# Altium project DASHBOARD_HW.PrjPcb
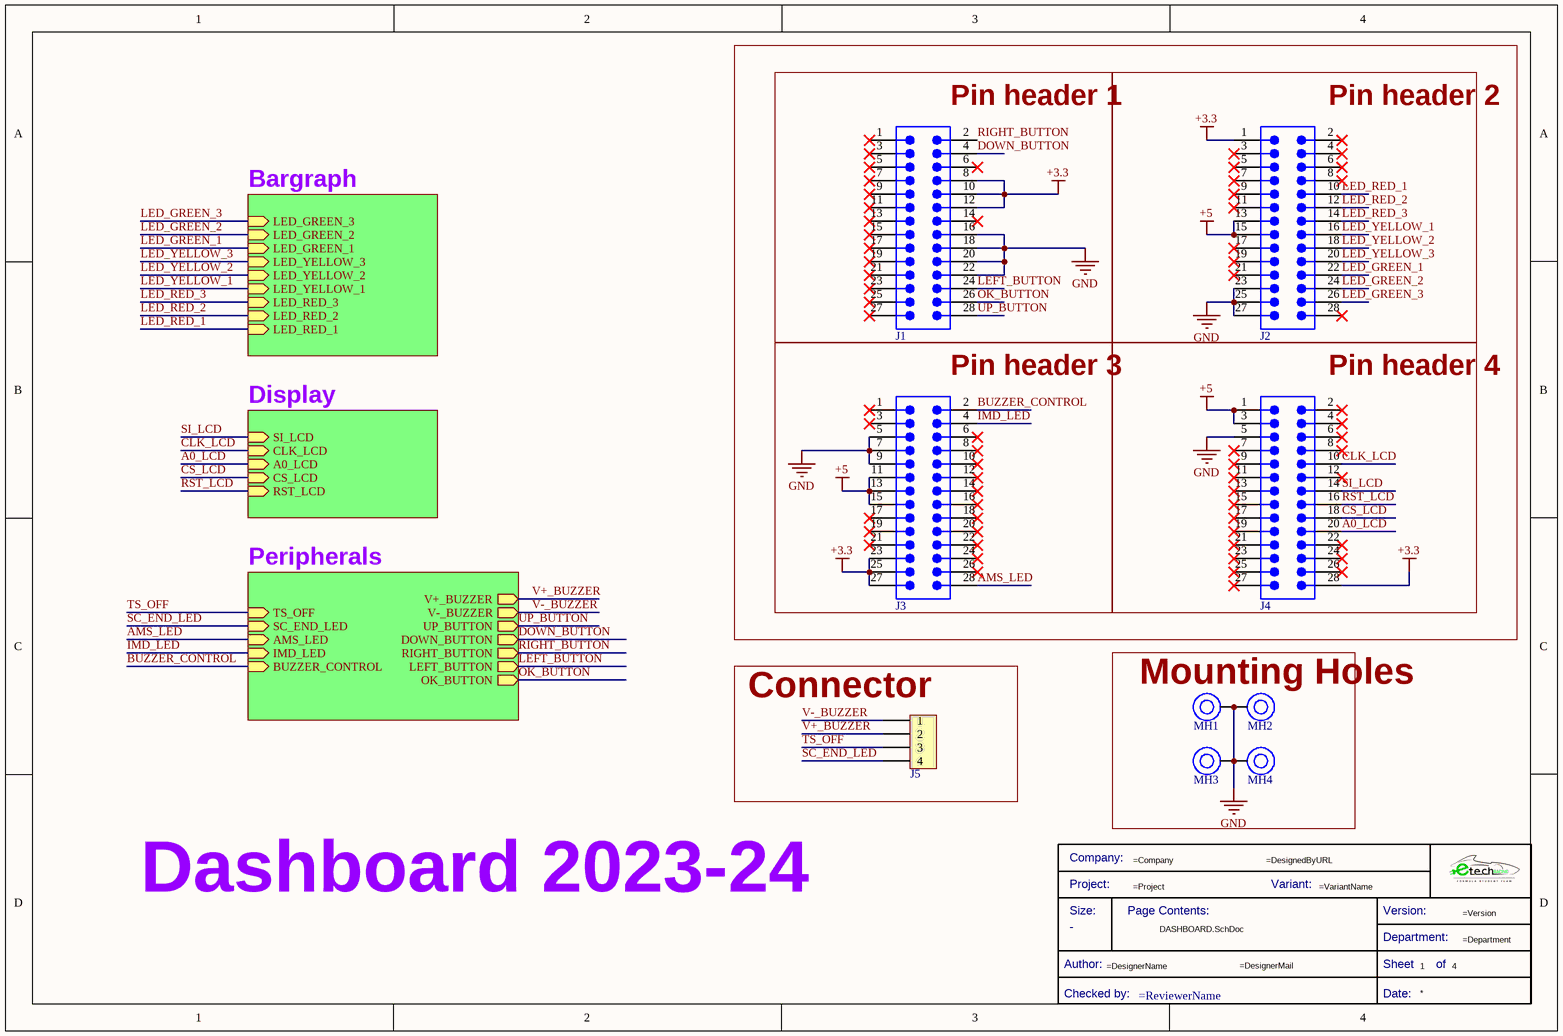
[diagram p0: DASHBOARD.SchDoc]
4 sheets, 98 parts. Net scope: hierarchical (ports join the sheet entries above them; power ports are global).
Board file: DASHBOARD.PcbDoc
Sheets:
  DASHBOARD.SchDoc
    Bargraph = Bargraph.SchDoc
    Display = Display.SchDoc
    Peripherals = Peripherals.SchDoc

## Sheet DASHBOARD.SchDoc
size A4; SheetNumber: 1; SheetTotal: 4

### Parts
(Parts that share a designator on the sheet are numbered #1, #2 ... from top to bottom, then left to right.)
*#1  Title Block_template  (value not drawn)  (graphical)
J1  62132821021  [62132821021]  (value not drawn)
J2  62132821021  [62132821021]  (value not drawn)
J3  62132821021  [62132821021]  (value not drawn)
J4  62132821021  [62132821021]  (value not drawn)
J5  436500400  [J_MicroFit_1x4]  (value not drawn)
MH1  Mounting_Hole_M3  [Mounting_Hole_M3]  (value not drawn)
MH2  Mounting_Hole_M3  [Mounting_Hole_M3]  (value not drawn)
MH3  Mounting_Hole_M3  [Mounting_Hole_M3]  (value not drawn)
MH4  Mounting_Hole_M3  [Mounting_Hole_M3]  (value not drawn)

### Blocks framed on the sheet
Pin header 1: J1
Pin header 2: J2
Pin header 3: J3
Pin header 4: J4
Connector: J5
Mounting Holes: MH1-MH4

### Sub-sheets
Bargraph = Bargraph: LED_GREEN_3 (in), LED_GREEN_2 (in), LED_GREEN_1 (in), LED_YELLOW_3 (in), LED_YELLOW_2 (in), LED_YELLOW_1 (in), LED_RED_3 (in), LED_RED_2 (in), LED_RED_1 (in)
Display = Display: SI_LCD (in), CLK_LCD (in), A0_LCD (in), CS_LCD (in), RST_LCD (in)
Peripherals = Peripherals.SchDoc: AMS_LED (in), IMD_LED (in), UP_BUTTON (out), DOWN_BUTTON (out), RIGHT_BUTTON (out), LEFT_BUTTON (out), OK_BUTTON (out), V+_BUZZER (out), V-_BUZZER (out), SC_END_LED (in), TS_OFF (in), BUZZER_CONTROL (in)

### Nets
+3.3: J1.8 J1.10 J1.12 J2.1 J3.23 J3.25 J3.27 J4.28
+5: J2.13 J2.15 J3.11 J3.13 J3.15 J4.1 J4.3
GND: J1.16 J1.18 J1.20 J1.22 J2.23 J2.25 J2.27 J3.5 J3.7 J3.9 J4.5 MH1.1 MH2.1 MH3.1 MH4.1
A0_LCD: J4.20 ; sheet Display/A0_LCD
AMS_LED: J3.28 ; sheet Peripherals/AMS_LED
BUZZER_CONTROL: J3.2 ; sheet Peripherals/BUZZER_CONTROL
CLK_LCD: J4.10 ; sheet Display/CLK_LCD
CS_LCD: J4.18 ; sheet Display/CS_LCD
DOWN_BUTTON: J1.4 ; sheet Peripherals/DOWN_BUTTON
IMD_LED: J3.4 ; sheet Peripherals/IMD_LED
LED_GREEN_1: J2.22 ; sheet Bargraph/LED_GREEN_1
LED_GREEN_2: J2.24 ; sheet Bargraph/LED_GREEN_2
LED_GREEN_3: J2.26 ; sheet Bargraph/LED_GREEN_3
LED_RED_1: J2.10 ; sheet Bargraph/LED_RED_1
LED_RED_2: J2.12 ; sheet Bargraph/LED_RED_2
LED_RED_3: J2.14 ; sheet Bargraph/LED_RED_3
LED_YELLOW_1: J2.16 ; sheet Bargraph/LED_YELLOW_1
LED_YELLOW_2: J2.18 ; sheet Bargraph/LED_YELLOW_2
LED_YELLOW_3: J2.20 ; sheet Bargraph/LED_YELLOW_3
LEFT_BUTTON: J1.24 ; sheet Peripherals/LEFT_BUTTON
OK_BUTTON: J1.26 ; sheet Peripherals/OK_BUTTON
RIGHT_BUTTON: J1.2 ; sheet Peripherals/RIGHT_BUTTON
RST_LCD: J4.16 ; sheet Display/RST_LCD
SC_END_LED: J5.4 ; sheet Peripherals/SC_END_LED
SI_LCD: J4.14 ; sheet Display/SI_LCD
TS_OFF: J5.3 ; sheet Peripherals/TS_OFF
UP_BUTTON: J1.28 ; sheet Peripherals/UP_BUTTON
V+_BUZZER: J5.2 ; sheet Peripherals/V+_BUZZER
V-_BUZZER: J5.1 ; sheet Peripherals/V-_BUZZER

Not connected (* = marked no-connect by the designer): J1 1* 3* 5* 6* 7* 9* 11* 13* 14* 15* 17* 19* 21* 23* 25* 27*; J2 2* 3* 4* 5* 6* 7* 8* 9* 11* 17* 19* 21* 28*; J3 1* 3* 6* 8* 10* 12* 14* 16* 17* 18* 19* 20* 21* 22* 24* 26*; J4 2* 4* 6* 7* 8* 9* 11* 12* 13* 15* 17* 19* 21* 22* 23* 24* 25* 26* 27*

### Notes on the sheet
- Dashboard 2023-24
- (in symbol Title Block_template) Company:; Project:; Variant:; Size:; Page Contents:; Version:; Department:; Author:; Sheet; of; Checked by:; Date:

### Library data of the parts
*#1 = Title Block_template: Standard Title Block; .Creator: GP; Category: Title Block; .PCBcheck: GP; .SCHcheck: GP; Checked by:: =ReviewerName; Size: -
J1-J4 = 62132821021: WR-PHD Pin Header, SMT, Vertical, pitch 1.27mm, 2 Row, 28P; Manufacturer: Wurth Elektronik; Contact Resistance: 20mΩ; Rated Current: 1A; Working Voltage: 100V; Withstanding Voltage: 500V; ComponentLink1Description: Website Link; ComponentLink1URL: https://www.we-online.com/redexpert/article/62132821021?ad; ComponentLink2Description: Datasheet Link; ComponentLink2URL: https://www.we-online.com/redexpert/spec/62132821021?ad; Manufacturer Part Number: 62132821021; Category: Board-to-Board Connectors; Match Code: WR-PHD; Mount: Surface Mount; Operating Temperature Max: 105°C; Operating Temperature Min: -40°C; Packaging: Tape and Reel; Gender: Pin Header; Number of Pins: 28; Number of Rows: 2; Orientation: Vertical; Pitch: 1.27mm
J5 = J_MicroFit_1x4: Connector Wire to Board Header 4 Position 3mm Solder Right Angle Thru-Hole Tray; Manufacturer 1: Molex; Manufacturer Part Number 1: 43650-0400; Current Rating: 5A; Voltage Rating: 600V; Contact Resistance: 10mR; Connector Type: Plug; Number of Positions: 4; Gender: Male; Voltage Rating (DC): 250V; Glow Wire Compliant: Compliant; Supplier 1: Farnell; RoHS: Yes; Category: Headers and Wire Housings; Stock 1: 4623; Pricing 1: 1=1,24000, 10=1,22000, 50=1,19000, 100=1,17000, 500=1,14000, 1000=1,12000 (EUR); Mount: Through Hole,Cable; Contact Material: Brass,Copper Alloy; Contact Plating: Tin; Color: Black; Housing Color: Black; Housing Material: Thermoplastic; Min Operating Temperature: -40°C; Max Operating Temperature: 105°C; Termination: Solder; Orientation: Right Angle; Number of Rows: 1; Packaging: Tray; Package Quantity: 2380; Number of Contacts: 4; Max Voltage Rating (AC): 600V; Number of Circuits: 4; Series: 43650; Length: 14.86mm; Height: 4.5mm; Pitch: 3mm; Depth: 3.6mm; Radiation Hardening: No; Halogen Free: Low Halogen; Lead Free: Contains Lead; Flammability Rating: UL94 V-0; RoHS Compliant: Yes; ComponentLink1URL: https://datasheet.ciiva.com/19462/884184-19462234.pdf?src-supplier=Jameco; ComponentLink1Description: https://datasheet.ciiva.com/19462/884184-19462234.pdf?src-supplier=Jameco; ComponentLink2URL: https://datasheet.ciiva.com/5151/0436500400-pcb-headers-148663-5151881.pdf?src-supplier=Mouser; ComponentLink2Description: https://datasheet.ciiva.com/5151/0436500400-pcb-headers-148663-5151881.pdf?src-supplier=Mouser; ComponentLink3URL: https://datasheet.ciiva.com/16085/0436500400-pcb-headers-16085752.pdf?src-supplier=Onlinecomponents.com; ComponentLink3Description: https://datasheet.ciiva.com/16085/0436500400-pcb-headers-16085752.pdf?src-supplier=Onlinecomponents.com; ComponentLink4URL: https://datasheet.ciiva.com/11748/0900766b80d6135b-11748178.pdf?src-supplier=RSComponents; ComponentLink4Description: https://datasheet.ciiva.com/11748/0900766b80d6135b-11748178.pdf?src-supplier=RSComponents; ComponentLink5URL: https://datasheet.ciiva.com/30221/142510436500400-pcb-headers-30221164.pdf?src-supplier=Onlinecomponents.com; ComponentLink5Description: https://datasheet.ciiva.com/30221/142510436500400-pcb-headers-30221164.pdf?src-supplier=Onlinecomponents.com; ComponentLink6URL: https://datasheet.ciiva.com/17080/70266896-17080471.pdf?src-supplier=Allied+Electronics; ComponentLink6Description: https://datasheet.ciiva.com/17080/70266896-17080471.pdf?src-supplier=Allied+Electronics; ComponentLink7URL: https://datasheet.ciiva.com/7094/1946229-7094763.pdf?src-supplier=Newark; ComponentLink7Description: https://datasheet.ciiva.com/7094/1946229-7094763.pdf?src-supplier=Newark; ComponentLink8URL: https://datasheet.ciiva.com/9449/0436500400-pcb-headers-9449446.pdf?src-supplier=Avnet; ComponentLink8Description: https://datasheet.ciiva.com/9449/0436500400-pcb-headers-9449446.pdf?src-supplier=Avnet; Supplier Part Number 1: 1012232

## Sheet Bargraph.SchDoc
size A4; SheetNumber: 2; SheetTotal: 4
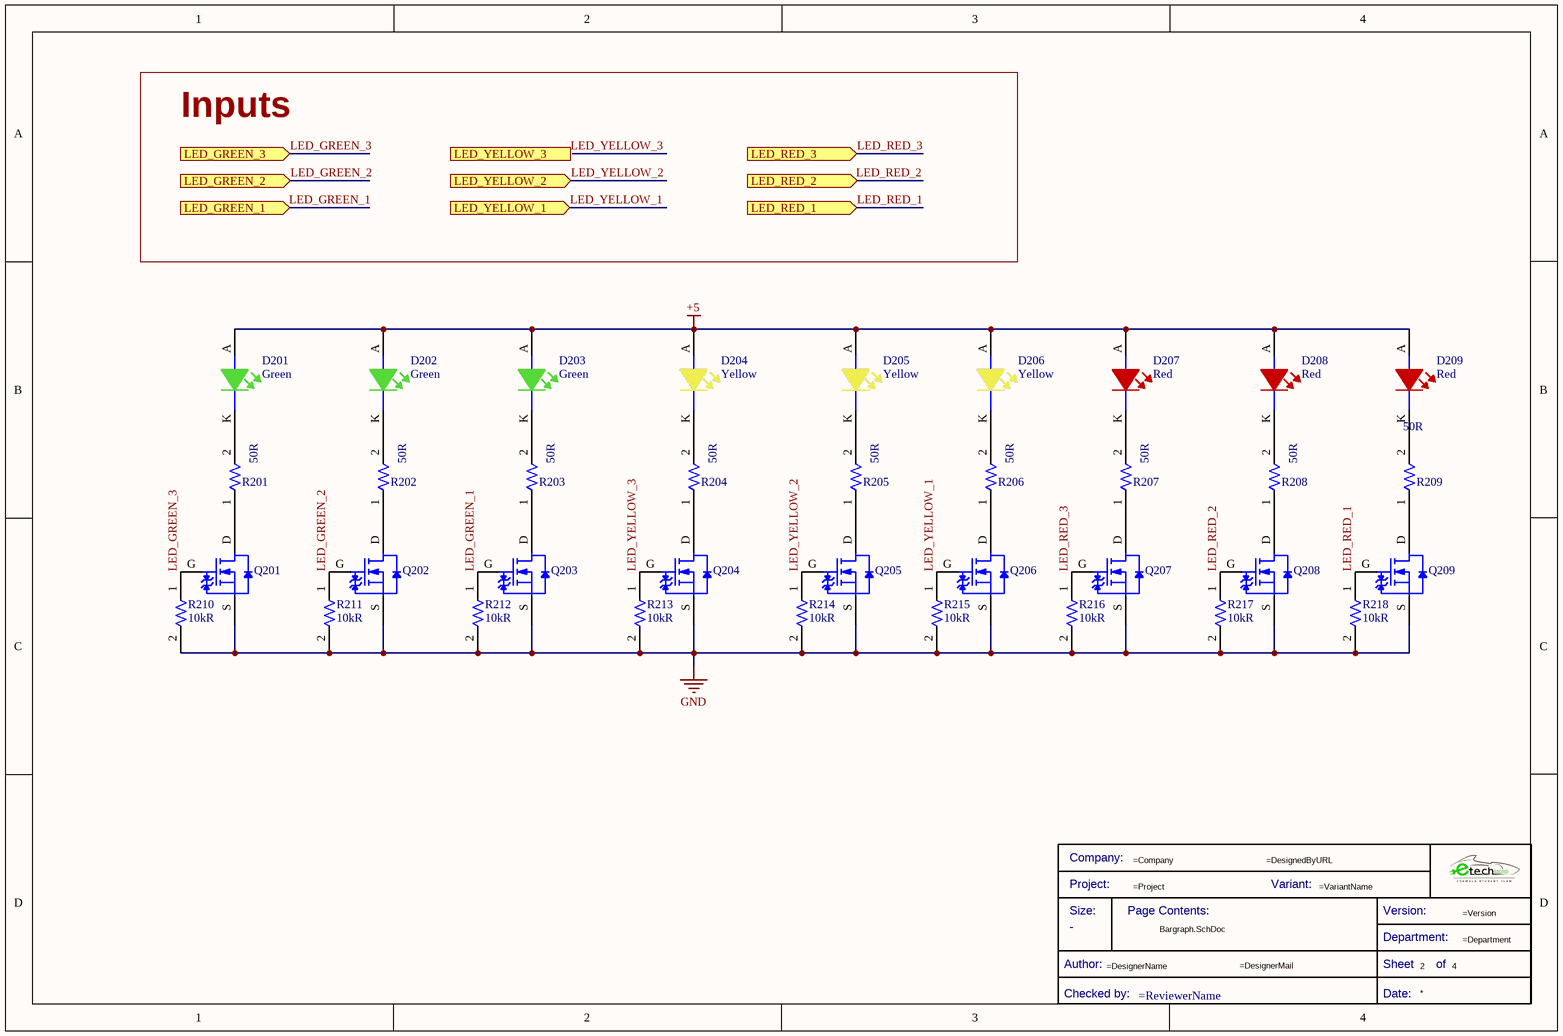
[diagram p1: Bargraph.SchDoc]

### Parts
(Parts that share a designator on the sheet are numbered #1, #2 ... from top to bottom, then left to right.)
*#2  Title Block_template  (value not drawn)  (graphical)
D201  Color: Green  [LED-THT/WE/D3.9H10.5]  (hidden comment: 150080GS75000)
D202  Color: Green  [LED-THT/WE/D3.9H10.5]  (hidden comment: 150080GS75000)
D203  Color: Green  [LED-THT/WE/D3.9H10.5]  (hidden comment: 150080GS75000)
D204  Color: Yellow  [LED-THT/WE/D3.9H10.5]  (hidden comment: 150080YS75000)
D205  Color: Yellow  [LED-THT/WE/D3.9H10.5]  (hidden comment: 150080YS75000)
D206  Color: Yellow  [LED-THT/WE/D3.9H10.5]  (hidden comment: 150080YS75000)
D207  Color: Red  [LED-THT/WE/D3.9H10.5]  (hidden comment: 150080RS75000)
D208  Color: Red  [LED-THT/WE/D3.9H10.5]  (hidden comment: 150080RS75000)
D209  Color: Red  [LED-THT/WE/D3.9H10.5]  (hidden comment: 150080RS75000)
Q201  CPH3455-TL-H  [TRT-NCH-3/35-CPH]  (value not drawn)
Q202  CPH3455-TL-H  [TRT-NCH-3/35-CPH]  (value not drawn)
Q203  CPH3455-TL-H  [TRT-NCH-3/35-CPH]  (value not drawn)
Q204  CPH3455-TL-H  [TRT-NCH-3/35-CPH]  (value not drawn)
Q205  CPH3455-TL-H  [TRT-NCH-3/35-CPH]  (value not drawn)
Q206  CPH3455-TL-H  [TRT-NCH-3/35-CPH]  (value not drawn)
Q207  CPH3455-TL-H  [TRT-NCH-3/35-CPH]  (value not drawn)
Q208  CPH3455-TL-H  [TRT-NCH-3/35-CPH]  (value not drawn)
Q209  CPH3455-TL-H  [TRT-NCH-3/35-CPH]  (value not drawn)
R201  value 50R  [R0805FTK]  (hidden comment: CRCW080550R0FKTA)
R202  value 50R  [R0805FTK]  (hidden comment: CRCW080550R0FKTA)
R203  value 50R  [R0805FTK]  (hidden comment: CRCW080550R0FKTA)
R204  value 50R  [R0805FTK]  (hidden comment: CRCW080550R0FKTA)
R205  value 50R  [R0805FTK]  (hidden comment: CRCW080550R0FKTA)
R206  value 50R  [R0805FTK]  (hidden comment: CRCW080550R0FKTA)
R207  value 50R  [R0805FTK]  (hidden comment: CRCW080550R0FKTA)
R208  value 50R  [R0805FTK]  (hidden comment: CRCW080550R0FKTA)
R209  value 50R  [R0805FTK]  (hidden comment: CRCW080550R0FKTA)
R210  Resistance: 10kR  [R0805FTK]  (hidden comment: CR0805-JW-103ELF)
R211  Resistance: 10kR  [R0805FTK]  (hidden comment: CR0805-JW-103ELF)
R212  Resistance: 10kR  [R0805FTK]  (hidden comment: CR0805-JW-103ELF)
R213  Resistance: 10kR  [R0805FTK]  (hidden comment: CR0805-JW-103ELF)
R214  Resistance: 10kR  [R0805FTK]  (hidden comment: CR0805-JW-103ELF)
R215  Resistance: 10kR  [R0805FTK]  (hidden comment: CR0805-JW-103ELF)
R216  Resistance: 10kR  [R0805FTK]  (hidden comment: CR0805-JW-103ELF)
R217  Resistance: 10kR  [R0805FTK]  (hidden comment: CR0805-JW-103ELF)
R218  Resistance: 10kR  [R0805FTK]  (hidden comment: CR0805-JW-103ELF)

### Ports
LED_GREEN_1 (in, see DASHBOARD[1A]), LED_GREEN_2 (in, see DASHBOARD[1A]), LED_GREEN_3 (in, see DASHBOARD[1A]), LED_RED_1 (in, see DASHBOARD[1B]), LED_RED_2 (in, see DASHBOARD[1B]), LED_RED_3 (in, see DASHBOARD[1B]), LED_YELLOW_1 (in, see DASHBOARD[1B]), LED_YELLOW_2 (in, see DASHBOARD[1B]), LED_YELLOW_3 (in, see DASHBOARD[1B])

### Nets
+5: D201.A D202.A D203.A D204.A D205.A D206.A D207.A D208.A D209.A
GND: Q201.S Q202.S Q203.S Q204.S Q205.S Q206.S Q207.S Q208.S Q209.S R210.2 R211.2 R212.2 R213.2 R214.2 R215.2 R216.2 R217.2 R218.2
LED_GREEN_1: Q203.G R212.1
LED_GREEN_2: Q202.G R211.1 ; port LED_GREEN_2
LED_GREEN_3: Q201.G R210.1 ; port LED_GREEN_3
LED_RED_1: Q209.G R218.1 ; port LED_RED_1
LED_RED_2: Q208.G R217.1
LED_RED_3: Q207.G R216.1 ; port LED_RED_3
LED_YELLOW_1: Q206.G R215.1 ; port LED_YELLOW_1
LED_YELLOW_2: Q205.G R214.1 ; port LED_YELLOW_2
LED_YELLOW_3: Q204.G R213.1 ; port LED_YELLOW_3
NetD201_K: D201.K R201.2
NetD202_K: D202.K R202.2
NetD203_K: D203.K R203.2
NetD204_K: D204.K R204.2
NetD205_K: D205.K R205.2
NetD206_K: D206.K R206.2
NetD207_K: D207.K R207.2
NetD208_K: D208.K R208.2
NetD209_K: D209.K R209.2
NetQ201_D: Q201.D R201.1
NetQ202_D: Q202.D R202.1
NetQ203_D: Q203.D R203.1
NetQ204_D: Q204.D R204.1
NetQ205_D: Q205.D R205.1
NetQ206_D: Q206.D R206.1
NetQ207_D: Q207.D R207.1
NetQ208_D: Q208.D R208.1
NetQ209_D: Q209.D R209.1

### Notes on the sheet
- Inputs
- Labels drawn without touching a wire or pin: LED_GREEN_1, LED_RED_2
- (in symbol Title Block_template) Company:; Project:; Variant:; Size:; Page Contents:; Version:; Department:; Author:; Sheet; of; Checked by:; Date:

### Library data of the parts
*#2 = Title Block_template: Standard Title Block; .Creator: GP; Category: Title Block; .PCBcheck: GP; .SCHcheck: GP; Checked by:: =ReviewerName; Size: -
D201-D203 = LEDGS-THT: Led, Green, 520 Nm, 3.2 V, 30 Ma, 450 Mcd Rohs Compliant: Yes; Manufacturer 1: Wurth Electronics; Viewing Angle: 140°; Lens Style: Clear,Rectangular; Luminous Intensity: 450mcd; Forward Voltage: 3.2V; Wavelength: 520nm; Forward Current: 30mA; Test Current: 20mA; .Creator: GP; ComponentLink1Description: Datasheet; ComponentLink1URL: https://www.we-online.com/catalog/datasheet/150080GS75000.pdf; ComponentLink2Description: Where buy it; ComponentLink2URL: https://katalog.we-online.de/en/led/WL-SMCW/150080GS75000; Supplier 1: RSComponents; Manufacturer Part Number 1: 150080GS75000; RoHS: Yes; Category: LEDs; Stock 1: 4350; Pricing 1: 50=0,19300, 500=0,12900, 1000=0,12300, 2000=0,11700, 4000=0,11100 (USD); Mount: Surface Mount; Case/Package: 0805; Case Code (Metric): 2012; Case Code (Imperial): 0805; Min Operating Temperature: -40°C; Max Operating Temperature: 85°C; Package Quantity: 4000; Packaging: Cut Tape; Dominant Wavelength: 520nm; Length: 2mm; Width: 1.25mm; Height: 0.7mm; REACH SVHC: Unknown; RoHS Compliant: Yes; ComponentLink3URL: https://datasheet.ciiva.com/29563/150080gs75000-29563008.pdf?src-supplier=Digi-Key; ComponentLink3Description: https://datasheet.ciiva.com/29563/150080gs75000-29563008.pdf?src-supplier=Digi-Key; ComponentLink4URL: https://datasheet.ciiva.com/29279/759434-da-01-en-chipled-0805-w-kl-gruen-150080gs75000-29279039.pdf?src-supplier=Conrad; ComponentLink4Description: https://datasheet.ciiva.com/29279/759434-da-01-en-chipled-0805-w-kl-gruen-150080gs75000-29279039.pdf?src-supplier=Conrad; Supplier Part Number 1: 8154221
D204-D206 = LEDYS-THT: 2 V Yellow LED 2012 (0805) SMD, Wurth Elektronik WL-SMCW 150080YS75000; Manufacturer 1: Wurth Electronics; Luminous Intensity: 120mcd; Forward Current: 30mA; Forward Voltage: 2V; Viewing Angle: 140°; Wavelength: 590nm; Lens Style: Clear,Rectangular; Test Current: 20mA; .Creator: DR; ComponentLink1Description: Datasheet; ComponentLink1URL: https://www.we-online.com/catalog/datasheet/150080YS75000.pdf; ComponentLink2Description: Where buy it; ComponentLink2URL: https://katalog.we-online.de/en/led/WL-SMCW/150080YS75000; Supplier 1: RSComponents; Manufacturer Part Number 1: 150080YS75000; RoHS: Yes; Category: LEDs; Stock 1: 2100; Pricing 1: 50=0,19300, 500=0,12900, 750=0,12300, 1500=0,11700, 3000=0,11100 (USD); Mount: Surface Mount; Case/Package: 0805; Case Code (Metric): 2012; Case Code (Imperial): 0805; Min Operating Temperature: -40°C; Max Operating Temperature: 85°C; Package Quantity: 4000; Packaging: Tape and Reel; Dominant Wavelength: 590nm; Length: 2mm; Width: 1.25mm; Height: 0.7mm; REACH SVHC: Unknown; RoHS Compliant: Yes; ComponentLink3URL: https://datasheet.ciiva.com/23843/150080ys75000-23843256.pdf?src-supplier=Newark; ComponentLink3Description: https://datasheet.ciiva.com/23843/150080ys75000-23843256.pdf?src-supplier=Newark; ComponentLink4URL: https://datasheet.ciiva.com/29279/759438-da-01-en-chipled-0805-w-kl-gelb-150080ys75000-29279034.pdf?src-supplier=Conrad; ComponentLink4Description: https://datasheet.ciiva.com/29279/759438-da-01-en-chipled-0805-w-kl-gelb-150080ys75000-29279034.pdf?src-supplier=Conrad; ComponentLink5URL: https://datasheet.ciiva.com/22656/1911353-22656971.pdf?src-supplier=Element14; ComponentLink5Description: https://datasheet.ciiva.com/22656/1911353-22656971.pdf?src-supplier=Element14; ComponentLink6URL: https://datasheet.ciiva.com/29563/150080ys75000-29563019.pdf?src-supplier=Digi-Key; ComponentLink6Description: https://datasheet.ciiva.com/29563/150080ys75000-29563019.pdf?src-supplier=Digi-Key; ComponentLink7URL: https://datasheet.ciiva.com/29563/150080ys75000-29563020.pdf?src-supplier=Digi-Key; ComponentLink7Description: https://datasheet.ciiva.com/29563/150080ys75000-29563020.pdf?src-supplier=Digi-Key; ComponentLink8URL: https://datasheet.ciiva.com/29563/150080ys75000-29563021.pdf?src-supplier=Digi-Key; ComponentLink8Description: https://datasheet.ciiva.com/29563/150080ys75000-29563021.pdf?src-supplier=Digi-Key; Supplier Part Number 1: 8154231
D207-D209 = LEDRS-THT: 0805(H=0.8mm) 红色 高亮 λD=625nm VF=2V IF=30mA PD=72mW; Manufacturer 1: Wurth Electronics; Luminous Intensity: 150mcd; Viewing Angle: 140°; Forward Voltage: 2V; Wavelength: 625nm; Lens Style: Clear,Rectangular; Forward Current: 30mA; Test Current: 20mA; .Creator: DR; ComponentLink1Description: Datasheet; ComponentLink1URL: https://www.we-online.com/catalog/datasheet/150080RS75000.pdf; ComponentLink2Description: Where buy it; ComponentLink2URL: https://katalog.we-online.de/en/led/WL-SMCW/150080RS75000; Supplier 1: RSComponents; Manufacturer Part Number 1: 150080RS75000; RoHS: Yes; Category: LEDs; Stock 1: 1; Pricing 1: 50=0,19300, 500=0,12900, 1000=0,12300, 2000=0,11700, 4000=0,11100 (USD); Mount: Surface Mount; Case/Package: 0805; Case Code (Metric): 2012; Case Code (Imperial): 0805; Min Operating Temperature: -40°C; Max Operating Temperature: 85°C; Package Quantity: 4000; Packaging: Tape and Reel; Dominant Wavelength: 625nm; Length: 2mm; Width: 1.25mm; Height: 0.7mm; REACH SVHC: Unknown; RoHS Compliant: Yes; ComponentLink3URL: https://datasheet.ciiva.com/22656/150080rs75000-22656961.pdf?src-supplier=Element14; ComponentLink3Description: https://datasheet.ciiva.com/22656/150080rs75000-22656961.pdf?src-supplier=Element14; ComponentLink4URL: https://datasheet.ciiva.com/29279/759435-da-01-en-chipled-0805-w-kl-rot-150080rs75000-29279032.pdf?src-supplier=Conrad; ComponentLink4Description: https://datasheet.ciiva.com/29279/759435-da-01-en-chipled-0805-w-kl-rot-150080rs75000-29279032.pdf?src-supplier=Conrad; Supplier Part Number 1: 8154225P
Q201-Q209 = TRT-NCH-3/35-CPH: CPH3455-TL-H N-channel MOSFET Transistor; 3 A; 35 V; 3-Pin CPH; Manufacturer: ON Semiconductor; Rds On Max: 104mR; Input Capacitance: 186pF; Rise Time: 4.7ns; Drain to Source Voltage (Vdss): 35V; Continuous Drain Current (ID): 3A; Max Power Dissipation: 1W; Drain to Source Resistance: 108mR; Turn-On Delay Time: 4.2ns; Turn-Off Delay Time: 15ns; Fall Time: 5.7ns; Element Configuration: Single; Gate to Source Voltage (Vgs): 20V; .Creator: GP; Category: Transistor; ComponentLink1Description: Datasheet; ComponentLink1URL: https://docs.rs-online.com/5847/0900766b812d514d.pdf; ComponentLink2Description: Where buy it; ComponentLink2URL: https://es.rs-online.com/web/p/mosfet/8009989; Supplier 1: RSComponents; Manufacturer Part Number: CPH3455-TL-H; RoHS: Yes; Stock 1: 1; Pricing 1: 50=0,50400 (USD); Case/Package: SC; Number of Pins: 3; Min Operating Temperature: -55°C; Max Operating Temperature: 150°C; Package Quantity: 3000; Packaging: Tape and Reel; Drain to Source Breakdown Voltage: 35V; Power Dissipation: 1W; Polarity: N-CHANNEL; Series: -; Length: 2.9mm; Width: 1.6mm; Height: 0.9mm; Lead Free: Lead Free; Halogen Free: Halogen Free; RoHS Compliant: Yes; ComponentLink3URL: https://datasheet.ciiva.com/947/cph3455-d-947201.pdf?src-supplier=Digi-Key; ComponentLink3Description: https://datasheet.ciiva.com/947/cph3455-d-947201.pdf?src-supplier=Digi-Key; ComponentLink4URL: https://datasheet.ciiva.com/4444/cph3455-d-91653-4444616.pdf?src-supplier=Mouser; ComponentLink4Description: https://datasheet.ciiva.com/4444/cph3455-d-91653-4444616.pdf?src-supplier=Mouser; ComponentLink5URL: https://datasheet.ciiva.com/11164/cph3455-d-11164889.pdf?src-supplier=Avnet; ComponentLink5Description: https://datasheet.ciiva.com/11164/cph3455-d-11164889.pdf?src-supplier=Avnet; Supplier Part Number 1: 8009989
R201-R209 = R50-0805FTK: Res Thick Film 0805 50 Ohm 1% 0.125W(1/8W) ±100ppm/C Pad SMD Automotive T/R; Manufacturer: Vishay Dale; Power Rating: 125mW; Voltage Rating: 150V; Temperature Coefficient: 100ppm/°C; Supplier 1: Mouser; Manufacturer Part Number: CRCW080550R0FKTA; RoHS: No; Category: Chip SMD Resistors; Stock 1: 38245; Pricing 1: 1=0,25, 10=0,204, 50=0,204, 100=0,08, 1000=0,033, 10000=0,026 (USD); Case/Package: 0805; Weight: 0.000194oz; Case Code (Imperial): 0805; Case Code (Metric): 2012; Contact Plating: Tin,Lead; Min Operating Temperature: -55°C; Max Operating Temperature: 155°C; Tolerance: 1%; Packaging: Tape and Reel; Package Quantity: 5000; Series: CRCW; Length: 2mm; Width: 1.25mm; Height: 0.45mm; Lead Free: Contains Lead; RoHS Compliant: No; ComponentLink1URL: https://datasheet.ciiva.com/48525/dcrcw-48525895.pdf?src-supplier=Avnet; ComponentLink1Description: https://datasheet.ciiva.com/48525/dcrcw-48525895.pdf?src-supplier=Avnet; Supplier Part Number 1: 71-CRCW0805-50
R210-R218 = R10k-0805FTK: BOURNS         CR0805-JW-103ELF            Surface Mount Chip Resistor, Thick Film, CR Series, 10 kohm, 125 mW,  5%, 150 V; Temperature Coefficient: 200ppm/°C; Power Rating: 125mW; Voltage Rating: 150V; Voltage Rating (DC): 100V; .Creator: DR; Supplier 1: Arrow Electronics; Manufacturer 1: Bourns; Manufacturer Part Number 1: CR0805-JW-103ELF; RoHS: Yes; Category: Chip SMD Resistors; Stock 1: 57566; Pricing 1: 1=0,05790, 10=0,01540, 25=0,01340, 100=0,00340 (USD); Mount: Surface Mount; Case/Package: 0805; Number of Pins: 2; Contact Plating: Tin; Case Code (Metric): 2012; Case Code (Imperial): 0805; Min Operating Temperature: -55°C; Max Operating Temperature: 155°C; Tolerance: 5%; Resistor Type: Thick Film; Package Quantity: 1; Packaging: Tape and Reel; Number of Terminations: 2; Termination: SMD/SMT; Max Power Dissipation: 125mW; Features: Moisture Resistant; Series: CR0805; Construction: Rectangular; Resistance Tolerance: 5%; Technology: THICK FILM; Length: 2mm; Width: 1.25mm; Height: 0.5mm; Depth: 1.25mm; Thickness: 508um; Radiation Hardening: No; REACH SVHC: No SVHC; Military Standard: Not; RoHS Compliant: Yes; ComponentLink1URL: https://datasheet.ciiva.com/11821/0900766b80fcdb72-11821135.pdf?src-supplier=RSComponents; ComponentLink1Description: https://datasheet.ciiva.com/11821/0900766b80fcdb72-11821135.pdf?src-supplier=RSComponents; ComponentLink2URL: https://datasheet.ciiva.com/9122/chpreztr-9122374.pdf?src-supplier=Avnet; ComponentLink2Description: https://datasheet.ciiva.com/9122/chpreztr-9122374.pdf?src-supplier=Avnet; ComponentLink3URL: https://datasheet.ciiva.com/22693/1902866-22693254.pdf?src-supplier=Element14; ComponentLink3Description: https://datasheet.ciiva.com/22693/1902866-22693254.pdf?src-supplier=Element14; ComponentLink4URL: https://datasheet.ciiva.com/7986/691949-7986187.pdf?src-supplier=Element14; ComponentLink4Description: https://datasheet.ciiva.com/7986/691949-7986187.pdf?src-supplier=Element14; ComponentLink5URL: https://datasheet.ciiva.com/30065/159chpreztr-30065976.pdf?src-supplier=Onlinecomponents.com; ComponentLink5Description: https://datasheet.ciiva.com/30065/159chpreztr-30065976.pdf?src-supplier=Onlinecomponents.com; ComponentLink6URL: https://datasheet.ciiva.com/16783/70154685-16783482.pdf?src-supplier=Allied+Electronics; ComponentLink6Description: https://datasheet.ciiva.com/16783/70154685-16783482.pdf?src-supplier=Allied+Electronics; ComponentLink7URL: https://datasheet.ciiva.com/5548/chpreztr-5548491.pdf?src-supplier=Mouser; ComponentLink7Description: https://datasheet.ciiva.com/5548/chpreztr-5548491.pdf?src-supplier=Mouser; ComponentLink8URL: https://datasheet.ciiva.com/6559/chpreztr-6559900.pdf?src-supplier=Digi-Key; ComponentLink8Description: https://datasheet.ciiva.com/6559/chpreztr-6559900.pdf?src-supplier=Digi-Key; ComponentLink9URL: https://datasheet.ciiva.com/6559/chpreztr-6559901.pdf?src-supplier=Digi-Key; ComponentLink9Description: https://datasheet.ciiva.com/6559/chpreztr-6559901.pdf?src-supplier=Digi-Key; ComponentLink10URL: https://datasheet.ciiva.com/7985/1856384-7985869.pdf?src-supplier=Element14; ComponentLink10Description: https://datasheet.ciiva.com/7985/1856384-7985869.pdf?src-supplier=Element14; ComponentLink11URL: https://datasheet.ciiva.com/48692/001055517-da-01-en-smd-wid-cr0805-jw-103elf-10k-ohm-1-8w-48692118.pdf?src-supplier=Conrad; ComponentLink11Description: https://datasheet.ciiva.com/48692/001055517-da-01-en-smd-wid-cr0805-jw-103elf-10k-ohm-1-8w-48692118.pdf?src-supplier=Conrad; Supplier Part Number 1: CR0805-JW-103ELF

## Sheet Display.SchDoc
size A4; SheetNumber: 3; SheetTotal: 4
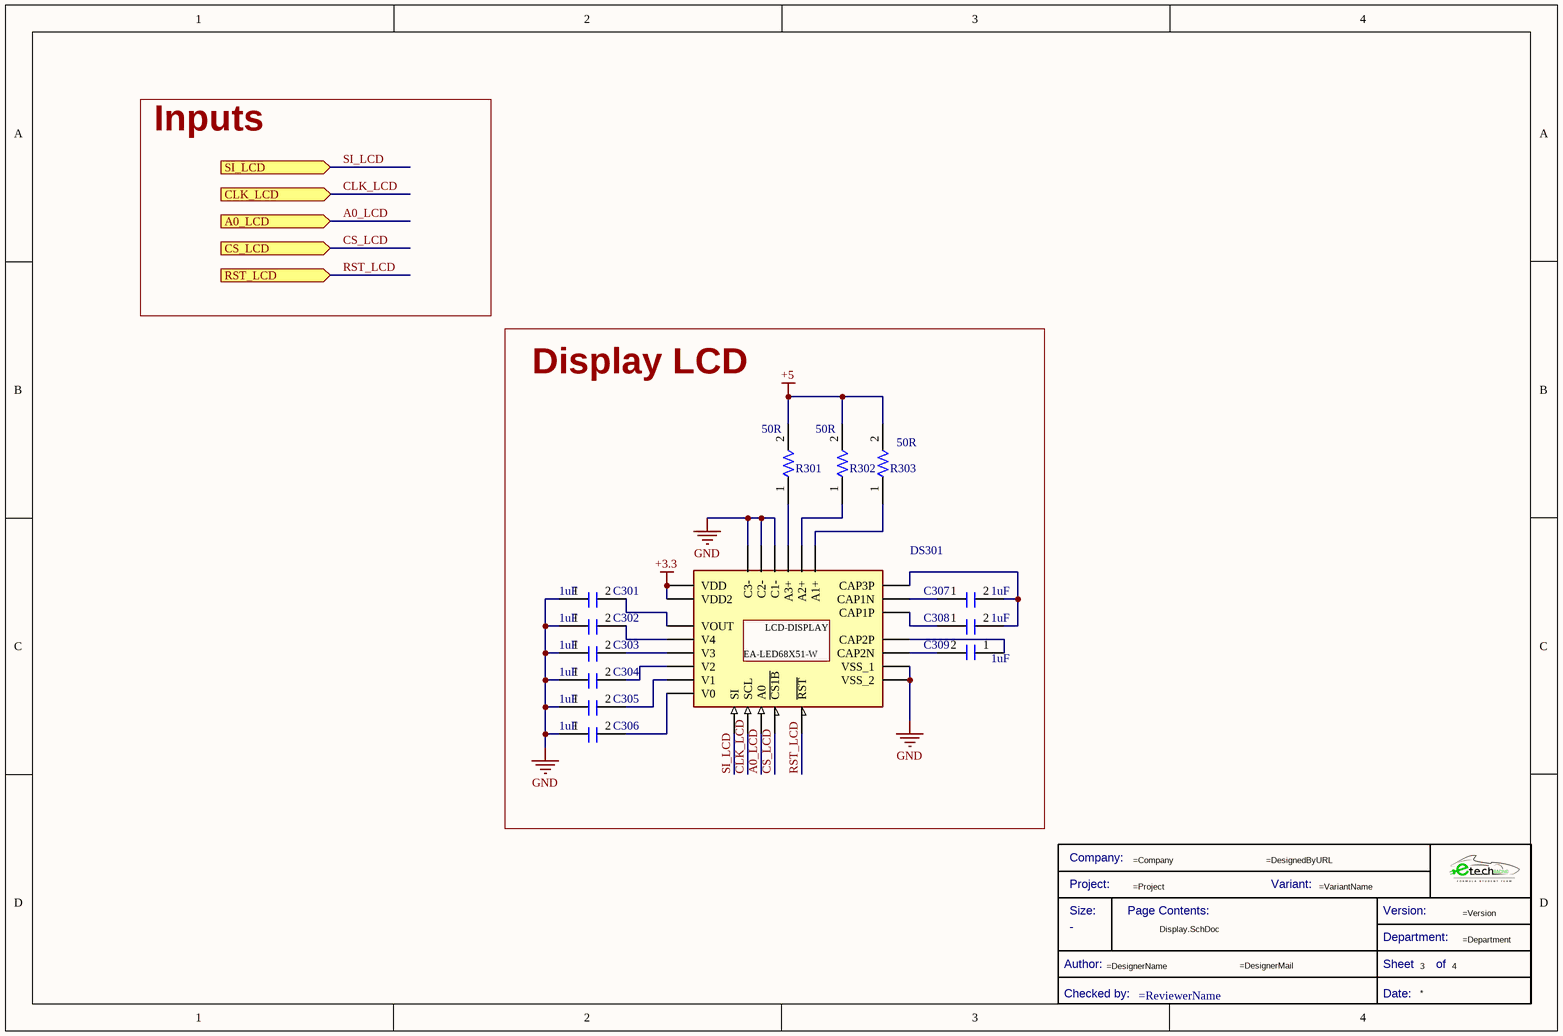
[diagram p2: Display.SchDoc]

### Parts
(Parts that share a designator on the sheet are numbered #1, #2 ... from top to bottom, then left to right.)
*#3  Title Block_template  (value not drawn)  (graphical)
C301  Capacitance: 1uF  [C0805FNPC-R]  (hidden comment: 885012207103)
C302  Capacitance: 1uF  [C0805FNPC-R]  (hidden comment: 885012207103)
C303  Capacitance: 1uF  [C0805FNPC-R]  (hidden comment: 885012207103)
C304  Capacitance: 1uF  [C0805FNPC-R]  (hidden comment: 885012207103)
C305  Capacitance: 1uF  [C0805FNPC-R]  (hidden comment: 885012207103)
C306  Capacitance: 1uF  [C0805FNPC-R]  (hidden comment: 885012207103)
C307  Capacitance: 1uF  [C0805FNPC-R]  (hidden comment: 885012207103)
C308  Capacitance: 1uF  [C0805FNPC-R]  (hidden comment: 885012207103)
C309  Capacitance: 1uF  [C0805FNPC-R]  (hidden comment: 885012207103)
DS301  EA_DOGL128W-6  [EA_DOGL128W-6]  (value not drawn)
R301  value 50R  [R0805FTK]  (hidden comment: CRCW080550R0FKTA)
R302  value 50R  [R0805FTK]  (hidden comment: CRCW080550R0FKTA)
R303  value 50R  [R0805FTK]  (hidden comment: CRCW080550R0FKTA)

### Blocks framed on the sheet
Display LCD: C301-C309 DS301 R301-R303

### Ports
A0_LCD (in, see DASHBOARD[1B]), CLK_LCD (in, see DASHBOARD[1B]), CS_LCD (in, see DASHBOARD[1B]), RST_LCD (in, see DASHBOARD[1C]), SI_LCD (in, see DASHBOARD[1B])

### Nets
+3.3: DS301.34(VDD2) DS301.35(VDD)
+5: R301.2 R302.2 R303.2
GND: C301.1 C302.1 C303.1 C304.1 C305.1 C306.1 DS301.18(C1-) DS301.19(C2-) DS301.20(C3-) DS301.26(VSS_1) DS301.33(VSS_2)
A0_LCD: DS301.38(A0) ; port A0_LCD
CLK_LCD: DS301.37(SCL) ; port CLK_LCD
CS_LCD: DS301.40(~{CS1B}) ; port CS_LCD
RST_LCD: DS301.39(~{RST}) ; port RST_LCD
SI_LCD: DS301.36(SI) ; port SI_LCD
NetC301_2: C301.2 DS301.32(VOUT)
NetC302_2: C302.2 DS301.25(V4)
NetC303_2: C303.2 DS301.24(V3)
NetC304_2: C304.2 DS301.23(V2)
NetC305_2: C305.2 DS301.22(V1)
NetC306_2: C306.2 DS301.21(V0)
NetC307_1: C307.1 DS301.30(CAP1N)
NetC307_2: C307.2 C308.2 DS301.31(CAP3P)
NetC308_1: C308.1 DS301.29(CAP1P)
NetC309_1: C309.1 DS301.28(CAP2P)
NetC309_2: C309.2 DS301.27(CAP2N)
NetDS301_1: DS301.1(A1+) R303.1
NetDS301_2: DS301.2(A2+) R302.1
NetDS301_3: DS301.3(A3+) R301.1

### Notes on the sheet
- Inputs
- (in symbol EA_DOGL128W-6) LCD-DISPLAY; EA-LED68X51-W
- (in symbol Title Block_template) Company:; Project:; Variant:; Size:; Page Contents:; Version:; Department:; Author:; Sheet; of; Checked by:; Date:

### Library data of the parts
*#3 = Title Block_template: Standard Title Block; .Creator: GP; Category: Title Block; .PCBcheck: GP; .SCHcheck: GP; Checked by:: =ReviewerName; Size: -
C301-C309 = C1u-50V-0805FNPC-X7R: Multilayer Ceramic Capacitor, Wcap-Csgp Series, 1 F, 10%, X7R, 50 V, 0805 [2012 Metric] Rohs Compliant: Yes; Manufacturer 1: Wurth Electronics; Voltage Rating: 50V; .Creator: GP; Supplier 1: RSComponents; Manufacturer Part Number 1: 885012207103; RoHS: Yes; Category: Ceramic Capacitors; Stock 1: 5100; Pricing 1: 50=0,27200, 250=0,25300, 500=0,22800, 1250=0,20100, 2500=0,17100 (GBP); Mount: Surface Mount; Case/Package: 0805; Case Code (Metric): 2012; Case Code (Imperial): 0805; Min Operating Temperature: -55°C; Max Operating Temperature: 85°C; Packaging: Cut Tape; Dielectric: X7R; Tolerance: 10%; Voltage Rating (DC): 50V; Length: 0.079inch; Width: 0.049inch; Thickness: 0.053inch; REACH SVHC: Unknown; RoHS Compliant: Yes; ComponentLink1URL: http://www.farnell.com/datasheets/1958501.pdf?src-supplier=Farnell; ComponentLink1Description: http://www.farnell.com/datasheets/1958501.pdf?src-supplier=Farnell; ComponentLink2URL: http://www.farnell.com/datasheets/1958501.pdf?src-supplier=Element14; ComponentLink2Description: http://www.farnell.com/datasheets/1958501.pdf?src-supplier=Element14; ComponentLink3URL: https://katalog.we-online.de/pbs/datasheet/885012107003.pdf?src-supplier=Digi-Key; ComponentLink3Description: https://katalog.we-online.de/pbs/datasheet/885012107003.pdf?src-supplier=Digi-Key; ComponentLink4URL: http://www.farnell.com/datasheets/1958501.pdf?src-supplier=Newark; ComponentLink4Description: http://www.farnell.com/datasheets/1958501.pdf?src-supplier=Newark; Supplier Part Number 1: 1813523
DS301 = EA_DOGL128W-6: LCD Graphic Display Modules & Accessories FSTN (+) Transflectv White Background; Manufacturer_Name: Electronic Assembly GmbH; Manufacturer_Part_Number: EA DOGL128W-6; Manufacturer: Electronic Assembly; Manufacturer Part Number: EADOGL128W-6; Nominal Supply Current: 270uA; Resolution (height): 64pixel; Resolution (width): 128pixel; Interface: SPI; Viewing Area (width): 64mm; Viewing Area (height): 35mm; .Creator: GP; Height: 2.8mm; Category: Display; ComponentLink1Description: Datasheet; ComponentLink1URL: http://www.lcd-module.com/eng/pdf/grafik/dogl128-6e.pdf; ComponentLink2Description: Where buy it; ComponentLink2URL: *; Supplier 1: Digi-Key; RoHS: No; Min Operating Temperature: -20°C; Max Operating Temperature: 70°C; Package Quantity: 16; Illumination Color: White; Background Color: White; Width: 67.8mm; ComponentLink3URL: https://datasheet.ciiva.com/14100/dogl128-6-eng-tds-14100350.pdf?src-supplier=Distrelec; ComponentLink3Description: https://datasheet.ciiva.com/14100/dogl128-6-eng-tds-14100350.pdf?src-supplier=Distrelec; Supplier Part Number 1: 1481-1058-ND
R301-R303 = R50-0805FTK: as R201 on sheet Bargraph; Supplier 1: Mouser; Manufacturer Part Number: CRCW080550R0FKTA; RoHS: No; Category: Chip SMD Resistors; Stock 1: 38245; Pricing 1: 1=0,25, 10=0,204, 50=0,204, 100=0,08, 1000=0,033, 10000=0,026 (USD); Case/Package: 0805; Weight: 0.000194oz; Case Code (Imperial): 0805; Case Code (Metric): 2012; Contact Plating: Tin,Lead; Min Operating Temperature: -55°C; Max Operating Temperature: 155°C; Tolerance: 1%; Packaging: Tape and Reel; Package Quantity: 5000; Series: CRCW; Length: 2mm; Width: 1.25mm; Height: 0.45mm; Lead Free: Contains Lead; RoHS Compliant: No; ComponentLink1URL: https://datasheet.ciiva.com/48525/dcrcw-48525895.pdf?src-supplier=Avnet; ComponentLink1Description: https://datasheet.ciiva.com/48525/dcrcw-48525895.pdf?src-supplier=Avnet; Supplier Part Number 1: 71-CRCW0805-50

## Sheet Peripherals.SchDoc
size A4; SheetNumber: 4; SheetTotal: 4
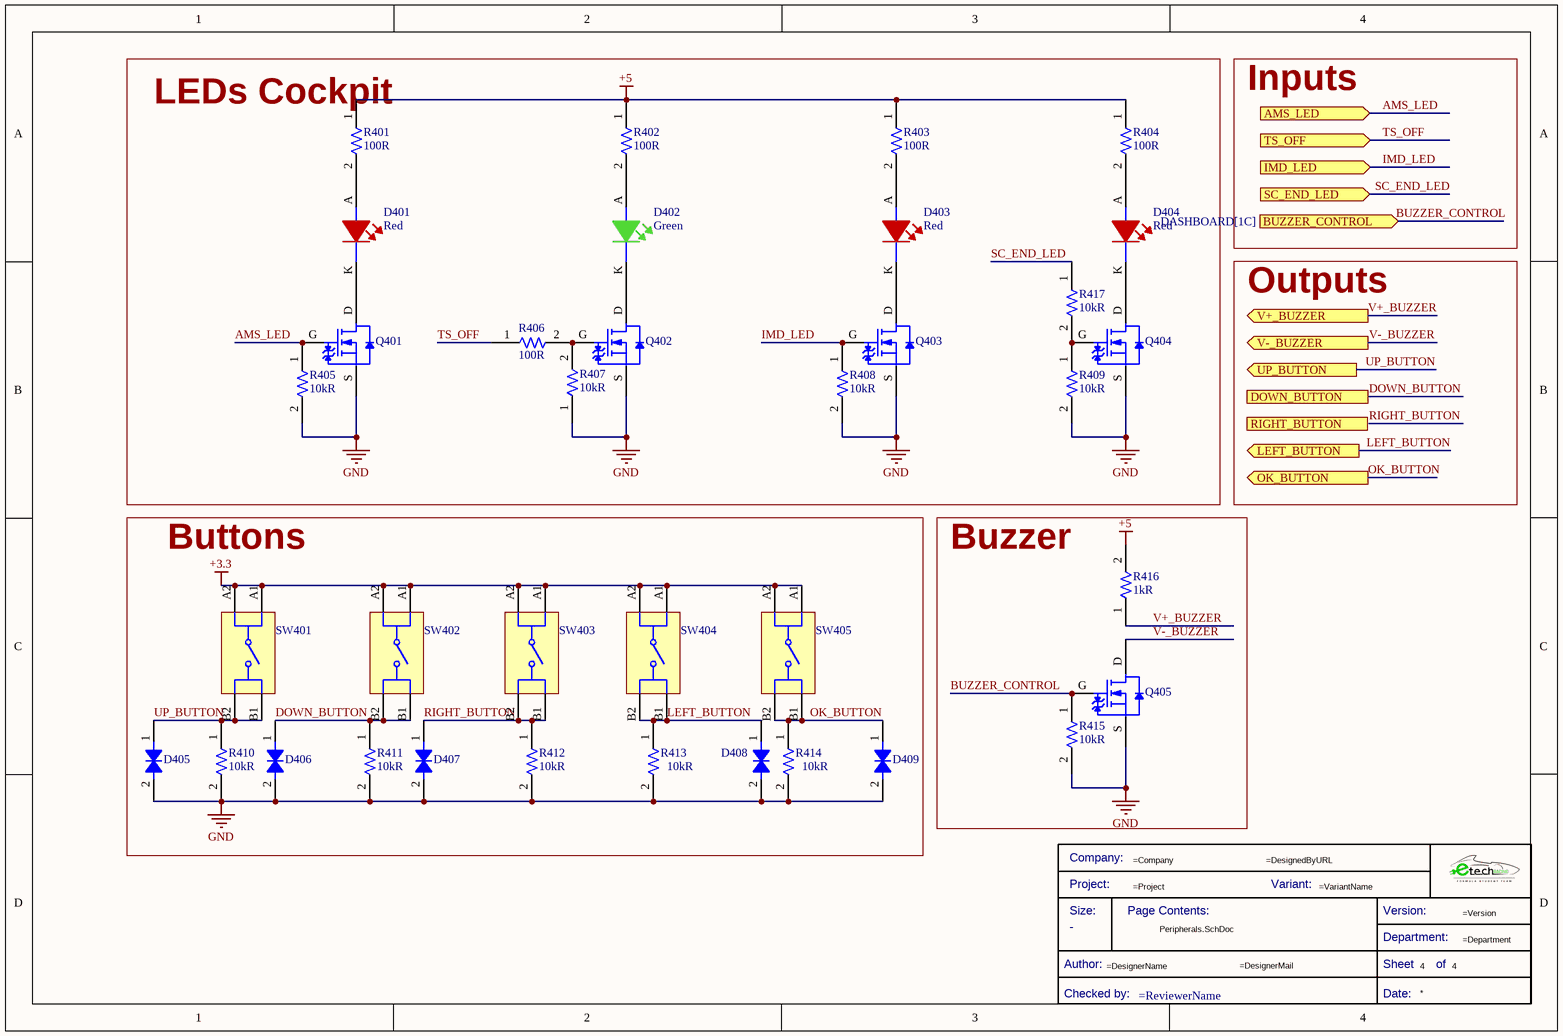
[diagram p3: Peripherals.SchDoc]

### Parts
(Parts that share a designator on the sheet are numbered #1, #2 ... from top to bottom, then left to right.)
*#4  Title Block_template  (value not drawn)  (graphical)
D401  Color: Red  [LED-THT/WE/D3.9H10.5]  (hidden comment: 150080RS75000)
D402  Color: Green  [LED-THT/WE/D3.9H10.5]  (hidden comment: 150080GS75000)
D403  Color: Red  [LED-THT/WE/D3.9H10.5]  (hidden comment: 150080RS75000)
D404  Color: Red  [LED-THT/WE/D3.9H10.5]  (hidden comment: 150080RS75000)
D405  824501600  [DTVS-DO-214AC]  (value not drawn)
D406  824501600  [DTVS-DO-214AC]  (value not drawn)
D407  824501600  [DTVS-DO-214AC]  (value not drawn)
D408  824501600  [DTVS-DO-214AC]  (value not drawn)
D409  824501600  [DTVS-DO-214AC]  (value not drawn)
Q401  SQ2318BES-T1_GE3  [TRT-NCH-3/35-CPH]  (value not drawn)
Q402  SQ2318BES-T1_GE3  [TRT-NCH-3/35-CPH]  (value not drawn)
Q403  SQ2318BES-T1_GE3  [TRT-NCH-3/35-CPH]  (value not drawn)
Q404  SQ2318BES-T1_GE3  [TRT-NCH-3/35-CPH]  (value not drawn)
Q405  SQ2318BES-T1_GE3  [TRT-NCH-3/35-CPH]  (value not drawn)
R401  Resistance: 100R  [R0805FTK]  (hidden comment: CR0805-FX-1000ELF)
R402  Resistance: 100R  [R0805FTK]  (hidden comment: CR0805-FX-1000ELF)
R403  Resistance: 100R  [R0805FTK]  (hidden comment: CR0805-FX-1000ELF)
R404  Resistance: 100R  [R0805FTK]  (hidden comment: CR0805-FX-1000ELF)
R405  Resistance: 10kR  [R0805FTK]  (hidden comment: CR0805-JW-103ELF)
R406  Resistance: 100R  [R0805FTK]  (hidden comment: CR0805-FX-1000ELF)
R407  Resistance: 10kR  [R0805FTK]  (hidden comment: CR0805-JW-103ELF)
R408  Resistance: 10kR  [R0805FTK]  (hidden comment: CR0805-JW-103ELF)
R409  Resistance: 10kR  [R0805FTK]  (hidden comment: CR0805-JW-103ELF)
R410  Resistance: 10kR  [R0805FTK]  (hidden comment: CR0805-JW-103ELF)
R411  Resistance: 10kR  [R0805FTK]  (hidden comment: CR0805-JW-103ELF)
R412  Resistance: 10kR  [R0805FTK]  (hidden comment: CR0805-JW-103ELF)
R413  Resistance: 10kR  [R0805FTK]  (hidden comment: CR0805-JW-103ELF)
R414  Resistance: 10kR  [R0805FTK]  (hidden comment: CR0805-JW-103ELF)
R415  Resistance: 10kR  [R0805FTK]  (hidden comment: CR0805-JW-103ELF)
R416  Resistance: 1kR  [R0805FTK]  (hidden comment: CR0805-JW-102ELF)
R417  Resistance: 10kR  [R0805FTK]  (hidden comment: CR0805-JW-104ELF)
SW401  430456073736  [SWITCH_12x12/4304x60737x6]  (value not drawn)
SW402  430456073736  [SWITCH_12x12/4304x60737x6]  (value not drawn)
SW403  430456073736  [SWITCH_12x12/4304x60737x6]  (value not drawn)
SW404  430456073736  [SWITCH_12x12/4304x60737x6]  (value not drawn)
SW405  430456073736  [SWITCH_12x12/4304x60737x6]  (value not drawn)

### Blocks framed on the sheet
LEDs Cockpit: D401-D404 Q401-Q404 R401-R409 R417
Buttons: D405-D409 R410-R414 SW401-SW405
Buzzer: Q405 R415 R416

### Ports
AMS_LED (in, see DASHBOARD[1C]), BUZZER_CONTROL (in, see DASHBOARD[1C]), DOWN_BUTTON (out, see DASHBOARD[2C]), IMD_LED (in, see DASHBOARD[1C]), LEFT_BUTTON (out, see DASHBOARD[2C]), OK_BUTTON (out, see DASHBOARD[2C]), RIGHT_BUTTON (out, see DASHBOARD[2C]), SC_END_LED (in, see DASHBOARD[1C]), TS_OFF (in, see DASHBOARD[1C]), UP_BUTTON (out, see DASHBOARD[2C]), V+_BUZZER (out, see DASHBOARD[2C]), V-_BUZZER (out, see DASHBOARD[2C])

### Nets
+3.3: SW401.A1 SW401.A2 SW402.A1 SW402.A2 SW403.A1 SW403.A2 SW404.A1 SW404.A2 SW405.A1 SW405.A2
+5: R401.1 R402.1 R403.1 R404.1 R416.2
GND: D405.2 D406.2 D407.2 D408.2 D409.2 Q401.S Q402.S Q403.S Q404.S Q405.S R405.2 R407.1 R408.2 R409.2 R410.2 R411.2 R412.2 R413.2 R414.2 R415.2
AMS_LED: Q401.G R405.1 ; port AMS_LED
BUZZER_CONTROL: Q405.G R415.1
DOWN_BUTTON: D406.1 R411.1 SW402.B1 SW402.B2
IMD_LED: Q403.G R408.1 ; port IMD_LED
LEFT_BUTTON: D408.1 R413.1 SW404.B1 SW404.B2 ; port LEFT_BUTTON
OK_BUTTON: D409.1 R414.1 SW405.B1 SW405.B2 ; port OK_BUTTON
RIGHT_BUTTON: D407.1 R412.1 SW403.B1 SW403.B2
SC_END_LED: R417.1 ; port SC_END_LED
TS_OFF: R406.1 ; port TS_OFF
UP_BUTTON: D405.1 R410.1 SW401.B1 SW401.B2 ; port UP_BUTTON
V+_BUZZER: R416.1 ; port V+_BUZZER
V-_BUZZER: Q405.D ; port V-_BUZZER
NetD401_A: D401.A R401.2
NetD401_K: D401.K Q401.D
NetD402_A: D402.A R402.2
NetD402_K: D402.K Q402.D
NetD403_A: D403.A R403.2
NetD403_K: D403.K Q403.D
NetD404_A: D404.A R404.2
NetD404_K: D404.K Q404.D
NetQ402_G: Q402.G R406.2 R407.2
NetQ404_G: Q404.G R409.1 R417.2

### Notes on the sheet
- Inputs
- Outputs
- Labels drawn without touching a wire or pin: BUZZER_CONTROL
- (in symbol Title Block_template) Company:; Project:; Variant:; Size:; Page Contents:; Version:; Department:; Author:; Sheet; of; Checked by:; Date:

### Library data of the parts
*#4 = Title Block_template: Standard Title Block; .Creator: GP; Category: Title Block; .PCBcheck: GP; .SCHcheck: GP; Checked by:: =ReviewerName; Size: -
D401 D403 D404 = LEDRS-THT: as D207 on sheet Bargraph; ComponentLink1Description: Datasheet; ComponentLink1URL: https://www.we-online.com/catalog/datasheet/150080RS75000.pdf; ComponentLink2Description: Where buy it; ComponentLink2URL: https://katalog.we-online.de/en/led/WL-SMCW/150080RS75000; Supplier 1: RSComponents; Manufacturer Part Number 1: 150080RS75000; RoHS: Yes; Category: LEDs; Stock 1: 1; Pricing 1: 50=0,19300, 500=0,12900, 1000=0,12300, 2000=0,11700, 4000=0,11100 (USD); Mount: Surface Mount; Case/Package: 0805; Case Code (Metric): 2012; Case Code (Imperial): 0805; Min Operating Temperature: -40°C; Max Operating Temperature: 85°C; Package Quantity: 4000; Packaging: Tape and Reel; Dominant Wavelength: 625nm; Length: 2mm; Width: 1.25mm; Height: 0.7mm; REACH SVHC: Unknown; RoHS Compliant: Yes; ComponentLink3URL: https://datasheet.ciiva.com/22656/150080rs75000-22656961.pdf?src-supplier=Element14; ComponentLink3Description: https://datasheet.ciiva.com/22656/150080rs75000-22656961.pdf?src-supplier=Element14; ComponentLink4URL: https://datasheet.ciiva.com/29279/759435-da-01-en-chipled-0805-w-kl-rot-150080rs75000-29279032.pdf?src-supplier=Conrad; ComponentLink4Description: https://datasheet.ciiva.com/29279/759435-da-01-en-chipled-0805-w-kl-rot-150080rs75000-29279032.pdf?src-supplier=Conrad; Supplier Part Number 1: 8154225P
D402 = LEDGS-THT: as D201 on sheet Bargraph; ComponentLink1Description: Datasheet; ComponentLink1URL: https://www.we-online.com/catalog/datasheet/150080GS75000.pdf; ComponentLink2Description: Where buy it; ComponentLink2URL: https://katalog.we-online.de/en/led/WL-SMCW/150080GS75000; Supplier 1: RSComponents; Manufacturer Part Number 1: 150080GS75000; RoHS: Yes; Category: LEDs; Stock 1: 4350; Pricing 1: 50=0,19300, 500=0,12900, 1000=0,12300, 2000=0,11700, 4000=0,11100 (USD); Mount: Surface Mount; Case/Package: 0805; Case Code (Metric): 2012; Case Code (Imperial): 0805; Min Operating Temperature: -40°C; Max Operating Temperature: 85°C; Package Quantity: 4000; Packaging: Cut Tape; Dominant Wavelength: 520nm; Length: 2mm; Width: 1.25mm; Height: 0.7mm; REACH SVHC: Unknown; RoHS Compliant: Yes; ComponentLink3URL: https://datasheet.ciiva.com/29563/150080gs75000-29563008.pdf?src-supplier=Digi-Key; ComponentLink3Description: https://datasheet.ciiva.com/29563/150080gs75000-29563008.pdf?src-supplier=Digi-Key; ComponentLink4URL: https://datasheet.ciiva.com/29279/759434-da-01-en-chipled-0805-w-kl-gruen-150080gs75000-29279039.pdf?src-supplier=Conrad; ComponentLink4Description: https://datasheet.ciiva.com/29279/759434-da-01-en-chipled-0805-w-kl-gruen-150080gs75000-29279039.pdf?src-supplier=Conrad; Supplier Part Number 1: 8154221
D405-D409 = DTVS-6V-DO-214AC: TVS diode [Würth Elektronik] 824501600 TVS diode; Manufacturer: Wurth Electronics; Number of Bidirectional Channels: 1; Reverse Standoff Voltage: 6V; Min Breakdown Voltage: 7.02V; Clamping Voltage: 10.3V; Peak Pulse Power: 400W; Power Line Protection: No; Polarity: Bidirectional; Peak Pulse Current: 38.8A; .Creator: DO; ComponentLink1Description: Where buy it; ComponentLink1URL: https://www.we-online.com/catalog/en/WE-TVSP?sq=824501600#824501600; Supplier 1: Mouser; Manufacturer Part Number: 824501600; RoHS: Yes; Category: TVS Diodes; Stock 1: 780; Pricing 1: 1=0,28000, 10=0,26100, 50=0,26100, 100=0,23400, 500=0,20400, 1000=0,17400, 10000=0,17400 (USD); Mount: Surface Mount; Number of Pins: 2; Min Operating Temperature: -65°C; Max Operating Temperature: 150°C; Packaging: Cut Tape; Max Breakdown Voltage: 7.02V; Resistor Type: Zener; REACH SVHC: Unknown; RoHS Compliant: Yes; ComponentLink2URL: http://www.farnell.com/datasheets/2036401.pdf?src-supplier=Element14; ComponentLink2Description: http://www.farnell.com/datasheets/2036401.pdf?src-supplier=Element14; Supplier Part Number 1: 710-824501600; ComponentLink3URL: https://katalog.we-online.de/pbs/datasheet/824501600.pdf?src-supplier=Digi-Key; ComponentLink3Description: https://katalog.we-online.de/pbs/datasheet/824501600.pdf?src-supplier=Digi-Key
Q401-Q405 = TRT-NCH-8/40-SQ: Automotive N-channel 40 V (d-s) 175C Mosfet SOT-23; Manufacturer 1: Vishay; Id: 8A; Vds: 40V; .Creator: DO; Supplier 1: Newark; Manufacturer Part Number 1: SQ2318BES-T1_GE3; RoHS: No; Pricing 1: 1=0,71500, 5=0,71500, 10=0,64400, 25=0,59000, 50=0,52500, 100=0,47100, 250=0,40800 (USD); Supplier Part Number 1: 81AH9290; ComponentLink1Description: Where to buy; ComponentLink1URL: https://www.mouser.es/ProductDetail/Vishay-Siliconix/SQ2318BES-T1_GE3?qs=sPbYRqrBIVmyZcxPsDt0vA%3D%3D; ComponentLink2Description: Datasheet; ComponentLink2URL: https://www.mouser.es/datasheet/2/427/sq2318bes-1868475.pdf
R401-R404 R406 = R100-0805FTK: Res Thick Film 0805 100 Ohm 1% 1/8W ±100ppm/°C Molded SMD SMD Paper Tape on Plastic Reel; Manufacturer 1: Bourns; Power Rating: 125mW; Voltage Rating: 150V; .Creator: DR; Supplier 1: Arrow Electronics; Manufacturer Part Number 1: CR0805-FX-1000ELF; RoHS: Yes; Category: Chip SMD Resistors; Stock 1: 49802; Pricing 1: 1=0,05840, 10=0,03430, 25=0,01780, 100=0,00750, 250=0,00560, 500=0,00490, 3000=0,00470 (USD); Mount: Surface Mount; Case/Package: 0805; Number of Pins: 2; Contact Plating: Tin; Case Code (Imperial): 0805; Case Code (Metric): 2012; Min Operating Temperature: -55°C; Max Operating Temperature: 155°C; Tolerance: 1%; Resistor Type: Thick Film; Temperature Coefficient: 100ppm/°C; Packaging: Tape and Reel; Package Quantity: 1; Termination: SMD/SMT; Number of Terminations: 2; Max Power Dissipation: 125mW; Voltage Rating (DC): 150V; Features: Moisture Resistant; Series: CR0805; Resistance Tolerance: 1%; Construction: Rectangular; Technology: THICK FILM; Length: 2mm; Width: 1.25mm; Height: 0.5mm; Depth: 1.25mm; Thickness: 508um; Radiation Hardening: No; REACH SVHC: No SVHC; Military Standard: Not; RoHS Compliant: Yes; ComponentLink1URL: https://datasheet.ciiva.com/11809/0900766b80fcdb72-11809178.pdf?src-supplier=RSComponents; ComponentLink1Description: https://datasheet.ciiva.com/11809/0900766b80fcdb72-11809178.pdf?src-supplier=RSComponents; ComponentLink2URL: https://datasheet.ciiva.com/6547/chpreztr-6547413.pdf?src-supplier=Digi-Key; ComponentLink2Description: https://datasheet.ciiva.com/6547/chpreztr-6547413.pdf?src-supplier=Digi-Key; ComponentLink3URL: https://datasheet.ciiva.com/6547/chpreztr-6547414.pdf?src-supplier=Digi-Key; ComponentLink3Description: https://datasheet.ciiva.com/6547/chpreztr-6547414.pdf?src-supplier=Digi-Key; ComponentLink4URL: https://datasheet.ciiva.com/6547/chpreztr-6547415.pdf?src-supplier=Digi-Key; ComponentLink4Description: https://datasheet.ciiva.com/6547/chpreztr-6547415.pdf?src-supplier=Digi-Key; ComponentLink5URL: https://datasheet.ciiva.com/9120/chpreztr-9120744.pdf?src-supplier=Avnet; ComponentLink5Description: https://datasheet.ciiva.com/9120/chpreztr-9120744.pdf?src-supplier=Avnet; Supplier Part Number 1: CR0805-FX-1000ELF
R405 R407-R415 R417 = R10k-0805FTK: as R210 on sheet Bargraph; Supplier 1: Arrow Electronics; Manufacturer 1: Bourns; Manufacturer Part Number 1: CR0805-JW-103ELF; RoHS: Yes; Category: Chip SMD Resistors; Stock 1: 57566; Pricing 1: 1=0,05790, 10=0,01540, 25=0,01340, 100=0,00340 (USD); Mount: Surface Mount; Case/Package: 0805; Number of Pins: 2; Contact Plating: Tin; Case Code (Metric): 2012; Case Code (Imperial): 0805; Min Operating Temperature: -55°C; Max Operating Temperature: 155°C; Tolerance: 5%; Resistor Type: Thick Film; Package Quantity: 1; Packaging: Tape and Reel; Number of Terminations: 2; Termination: SMD/SMT; Max Power Dissipation: 125mW; Features: Moisture Resistant; Series: CR0805; Construction: Rectangular; Resistance Tolerance: 5%; Technology: THICK FILM; Length: 2mm; Width: 1.25mm; Height: 0.5mm; Depth: 1.25mm; Thickness: 508um; Radiation Hardening: No; REACH SVHC: No SVHC; Military Standard: Not; RoHS Compliant: Yes; ComponentLink1URL: https://datasheet.ciiva.com/11821/0900766b80fcdb72-11821135.pdf?src-supplier=RSComponents; ComponentLink1Description: https://datasheet.ciiva.com/11821/0900766b80fcdb72-11821135.pdf?src-supplier=RSComponents; ComponentLink2URL: https://datasheet.ciiva.com/9122/chpreztr-9122374.pdf?src-supplier=Avnet; ComponentLink2Description: https://datasheet.ciiva.com/9122/chpreztr-9122374.pdf?src-supplier=Avnet; ComponentLink3URL: https://datasheet.ciiva.com/22693/1902866-22693254.pdf?src-supplier=Element14; ComponentLink3Description: https://datasheet.ciiva.com/22693/1902866-22693254.pdf?src-supplier=Element14; ComponentLink4URL: https://datasheet.ciiva.com/7986/691949-7986187.pdf?src-supplier=Element14; ComponentLink4Description: https://datasheet.ciiva.com/7986/691949-7986187.pdf?src-supplier=Element14; ComponentLink5URL: https://datasheet.ciiva.com/30065/159chpreztr-30065976.pdf?src-supplier=Onlinecomponents.com; ComponentLink5Description: https://datasheet.ciiva.com/30065/159chpreztr-30065976.pdf?src-supplier=Onlinecomponents.com; ComponentLink6URL: https://datasheet.ciiva.com/16783/70154685-16783482.pdf?src-supplier=Allied+Electronics; ComponentLink6Description: https://datasheet.ciiva.com/16783/70154685-16783482.pdf?src-supplier=Allied+Electronics; ComponentLink7URL: https://datasheet.ciiva.com/5548/chpreztr-5548491.pdf?src-supplier=Mouser; ComponentLink7Description: https://datasheet.ciiva.com/5548/chpreztr-5548491.pdf?src-supplier=Mouser; ComponentLink8URL: https://datasheet.ciiva.com/6559/chpreztr-6559900.pdf?src-supplier=Digi-Key; ComponentLink8Description: https://datasheet.ciiva.com/6559/chpreztr-6559900.pdf?src-supplier=Digi-Key; ComponentLink9URL: https://datasheet.ciiva.com/6559/chpreztr-6559901.pdf?src-supplier=Digi-Key; ComponentLink9Description: https://datasheet.ciiva.com/6559/chpreztr-6559901.pdf?src-supplier=Digi-Key; ComponentLink10URL: https://datasheet.ciiva.com/7985/1856384-7985869.pdf?src-supplier=Element14; ComponentLink10Description: https://datasheet.ciiva.com/7985/1856384-7985869.pdf?src-supplier=Element14; ComponentLink11URL: https://datasheet.ciiva.com/48692/001055517-da-01-en-smd-wid-cr0805-jw-103elf-10k-ohm-1-8w-48692118.pdf?src-supplier=Conrad; ComponentLink11Description: https://datasheet.ciiva.com/48692/001055517-da-01-en-smd-wid-cr0805-jw-103elf-10k-ohm-1-8w-48692118.pdf?src-supplier=Conrad; Supplier Part Number 1: CR0805-JW-103ELF
R416 = R1k-0805FTK: Res Thick Film 0805 1K Ohm 5% 1/8W ±200ppm/°C Molded SMD SMD Paper Tape on Plastic Reel; Manufacturer 1: Bourns; Voltage Rating (DC): 150V; Power Rating: 125mW; .Creator: GP; Supplier 1: Arrow Electronics; Manufacturer Part Number 1: CR0805-JW-102ELF; RoHS: Yes; Category: Chip SMD Resistors; Stock 1: 27510; Pricing 1: 1=0,05930, 10=0,03510, 25=0,01790, 100=0,00800, 250=0,00790, 500=0,00590, 1000=0,00360, 3000=0,00350, 6000=0,00250 (USD); Mount: Surface Mount; Case/Package: 0805; Number of Pins: 2; Contact Plating: Tin; Case Code (Metric): 2012; Case Code (Imperial): 0805; Min Operating Temperature: -55°C; Max Operating Temperature: 155°C; Resistor Type: Thick Film; Tolerance: 5%; Temperature Coefficient: 200ppm/°C; Features: Moisture Resistant; Package Quantity: 1; Packaging: Tape and Reel; Voltage Rating: 150V; Number of Terminations: 2; Termination: SMD/SMT; Max Power Dissipation: 125mW; Length: 2mm; Width: 1.25mm; Height: 0.5mm; Thickness: 508um; Depth: 1.25mm; Radiation Hardening: No; Lead Free: Lead Free; REACH SVHC: No SVHC; Military Standard: Not; ComponentLink1URL: https://datasheet.ciiva.com/11821/0900766b80fcdb72-11821134.pdf?src-supplier=RSComponents; ComponentLink1Description: https://datasheet.ciiva.com/11821/0900766b80fcdb72-11821134.pdf?src-supplier=RSComponents; ComponentLink2URL: https://datasheet.ciiva.com/15225/getdatasheetpartid-78155-15225381.pdf?src-supplier=Verical; ComponentLink2Description: https://datasheet.ciiva.com/15225/getdatasheetpartid-78155-15225381.pdf?src-supplier=Verical; ComponentLink3URL: https://datasheet.ciiva.com/22693/1902866-22693253.pdf?src-supplier=Element14; ComponentLink3Description: https://datasheet.ciiva.com/22693/1902866-22693253.pdf?src-supplier=Element14; ComponentLink4URL: https://datasheet.ciiva.com/7986/1856384-7986184.pdf?src-supplier=Element14; ComponentLink4Description: https://datasheet.ciiva.com/7986/1856384-7986184.pdf?src-supplier=Element14; ComponentLink5URL: https://datasheet.ciiva.com/7985/1856384-7985867.pdf?src-supplier=Element14; ComponentLink5Description: https://datasheet.ciiva.com/7985/1856384-7985867.pdf?src-supplier=Element14; ComponentLink6URL: https://datasheet.ciiva.com/30242/159chpreztr-30242765.pdf?src-supplier=Onlinecomponents.com; ComponentLink6Description: https://datasheet.ciiva.com/30242/159chpreztr-30242765.pdf?src-supplier=Onlinecomponents.com; ComponentLink7URL: https://datasheet.ciiva.com/6547/chpreztr-6547359.pdf?src-supplier=Digi-Key; ComponentLink7Description: https://datasheet.ciiva.com/6547/chpreztr-6547359.pdf?src-supplier=Digi-Key; Supplier Part Number 1: CR0805-JW-102ELF
SW401-SW405 = Switch_THT_NO/430456073736: WS-TATV THT Washable Tact Switch 12x12mm, SPST-NO, 12VDC, 50mA, 360g; Supplier 1: Rs; Supplier Part Number 1: 7856320

## Nets that join several sheets
+3.3: DASHBOARD (8 pins), Display (DS301.34 DS301.35), Peripherals (10 pins)
+5: DASHBOARD (7 pins), Bargraph (9 pins), Display (R301.2 R302.2 R303.2), Peripherals (5 pins)
GND: DASHBOARD (15 pins), Bargraph (18 pins), Display (11 pins), Peripherals (20 pins)
A0_LCD: DASHBOARD (J4.20), Display (DS301.38)
AMS_LED: DASHBOARD (J3.28), Peripherals (Q401.G R405.1)
CLK_LCD: DASHBOARD (J4.10), Display (DS301.37)
CS_LCD: DASHBOARD (J4.18), Display (DS301.40)
IMD_LED: DASHBOARD (J3.4), Peripherals (Q403.G R408.1)
LED_GREEN_2: DASHBOARD (J2.24), Bargraph (Q202.G R211.1)
LED_GREEN_3: DASHBOARD (J2.26), Bargraph (Q201.G R210.1)
LED_RED_1: DASHBOARD (J2.10), Bargraph (Q209.G R218.1)
LED_RED_3: DASHBOARD (J2.14), Bargraph (Q207.G R216.1)
LED_YELLOW_1: DASHBOARD (J2.16), Bargraph (Q206.G R215.1)
LED_YELLOW_2: DASHBOARD (J2.18), Bargraph (Q205.G R214.1)
LED_YELLOW_3: DASHBOARD (J2.20), Bargraph (Q204.G R213.1)
LEFT_BUTTON: DASHBOARD (J1.24), Peripherals (D408.1 R413.1 SW404.B1 SW404.B2)
OK_BUTTON: DASHBOARD (J1.26), Peripherals (D409.1 R414.1 SW405.B1 SW405.B2)
RST_LCD: DASHBOARD (J4.16), Display (DS301.39)
SC_END_LED: DASHBOARD (J5.4), Peripherals (R417.1)
SI_LCD: DASHBOARD (J4.14), Display (DS301.36)
TS_OFF: DASHBOARD (J5.3), Peripherals (R406.1)
UP_BUTTON: DASHBOARD (J1.28), Peripherals (D405.1 R410.1 SW401.B1 SW401.B2)
V+_BUZZER: DASHBOARD (J5.2), Peripherals (R416.1)
V-_BUZZER: DASHBOARD (J5.1), Peripherals (Q405.D)